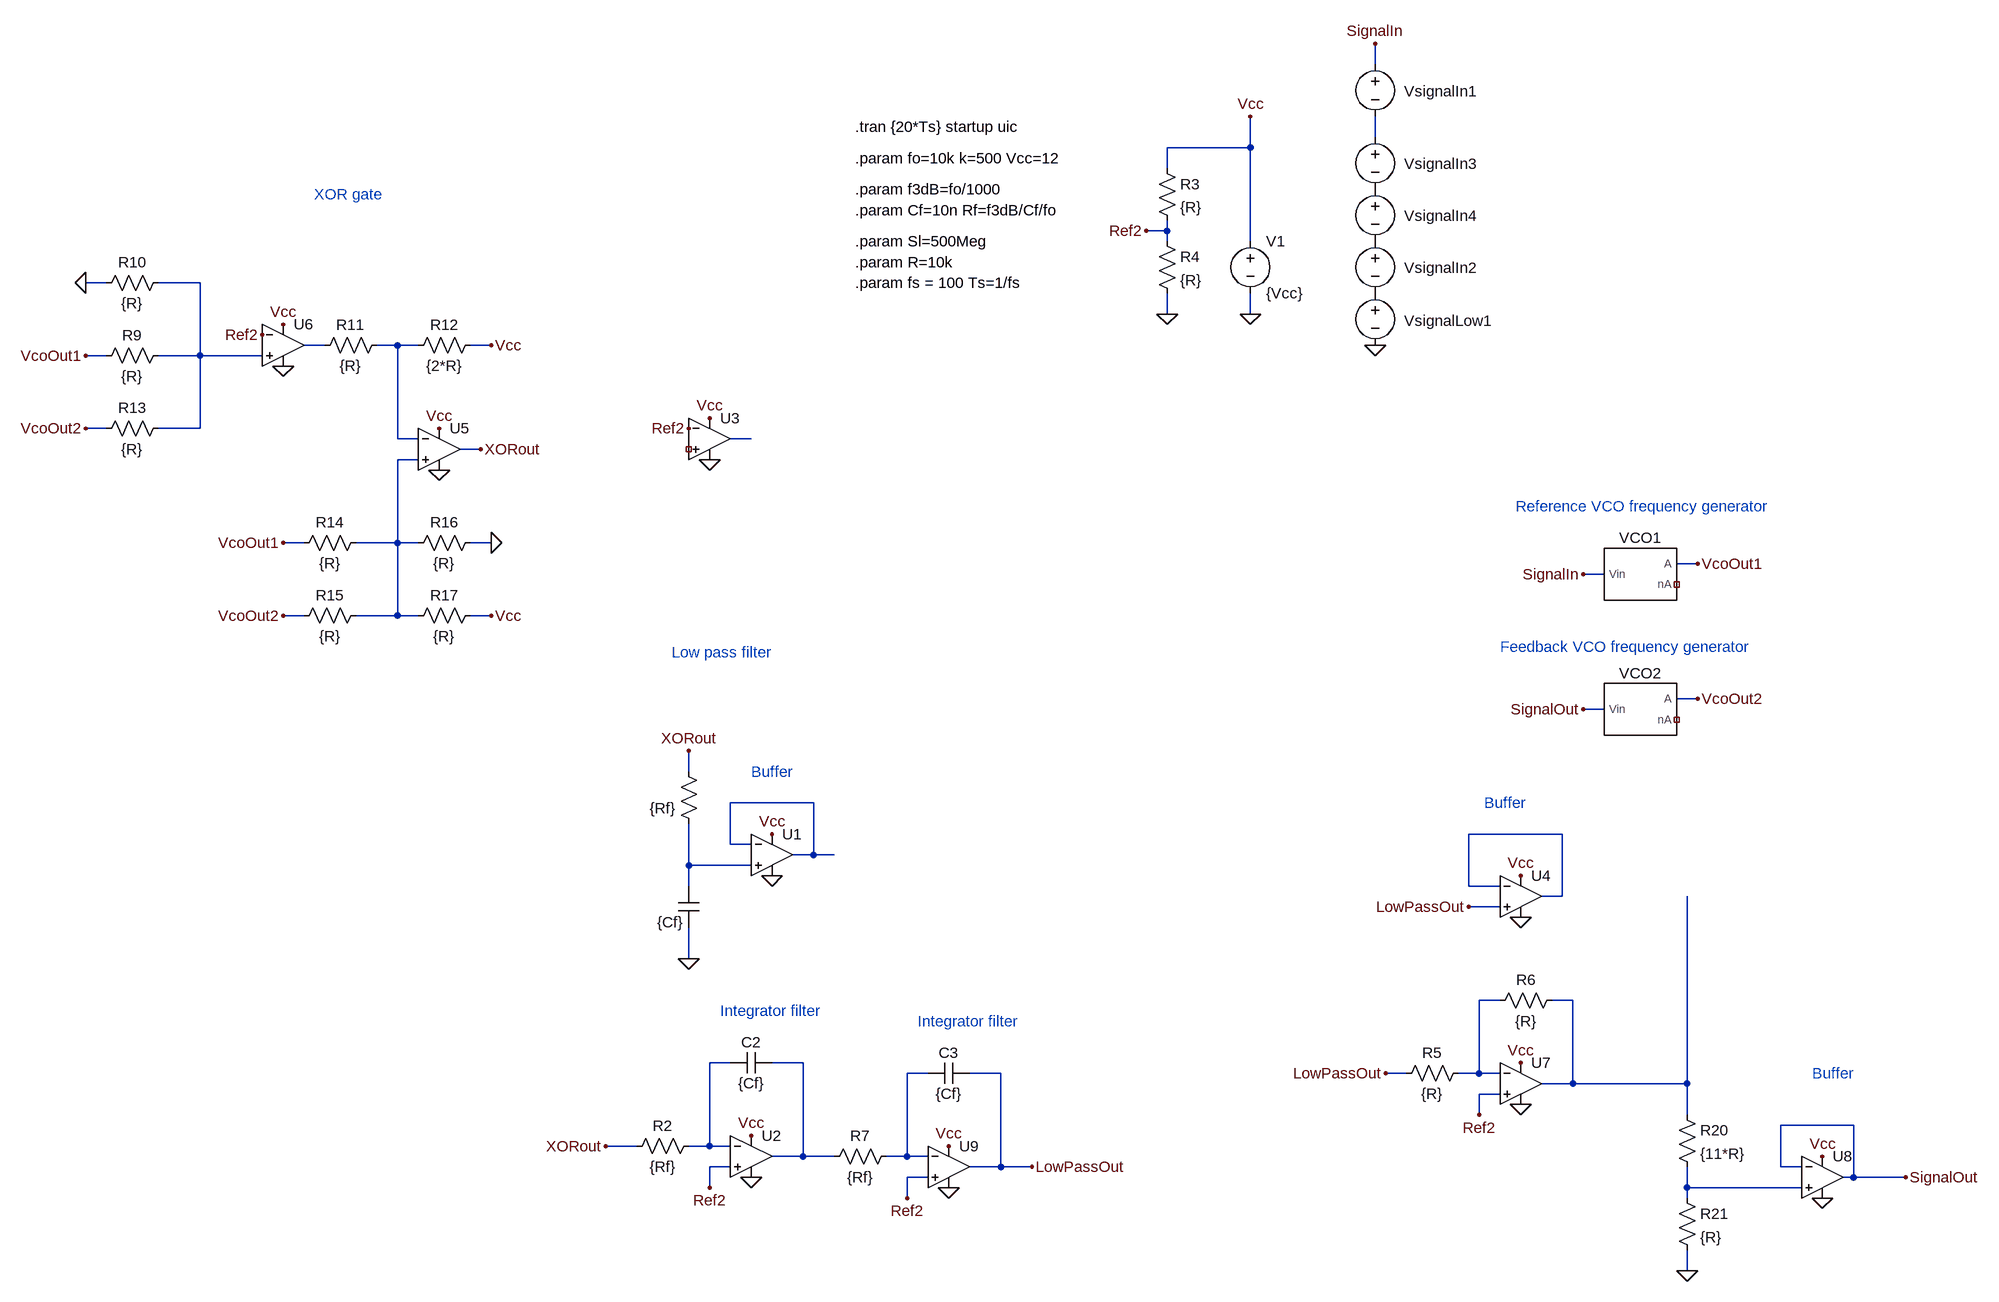
[diagram p0: schematic pll4.asc]
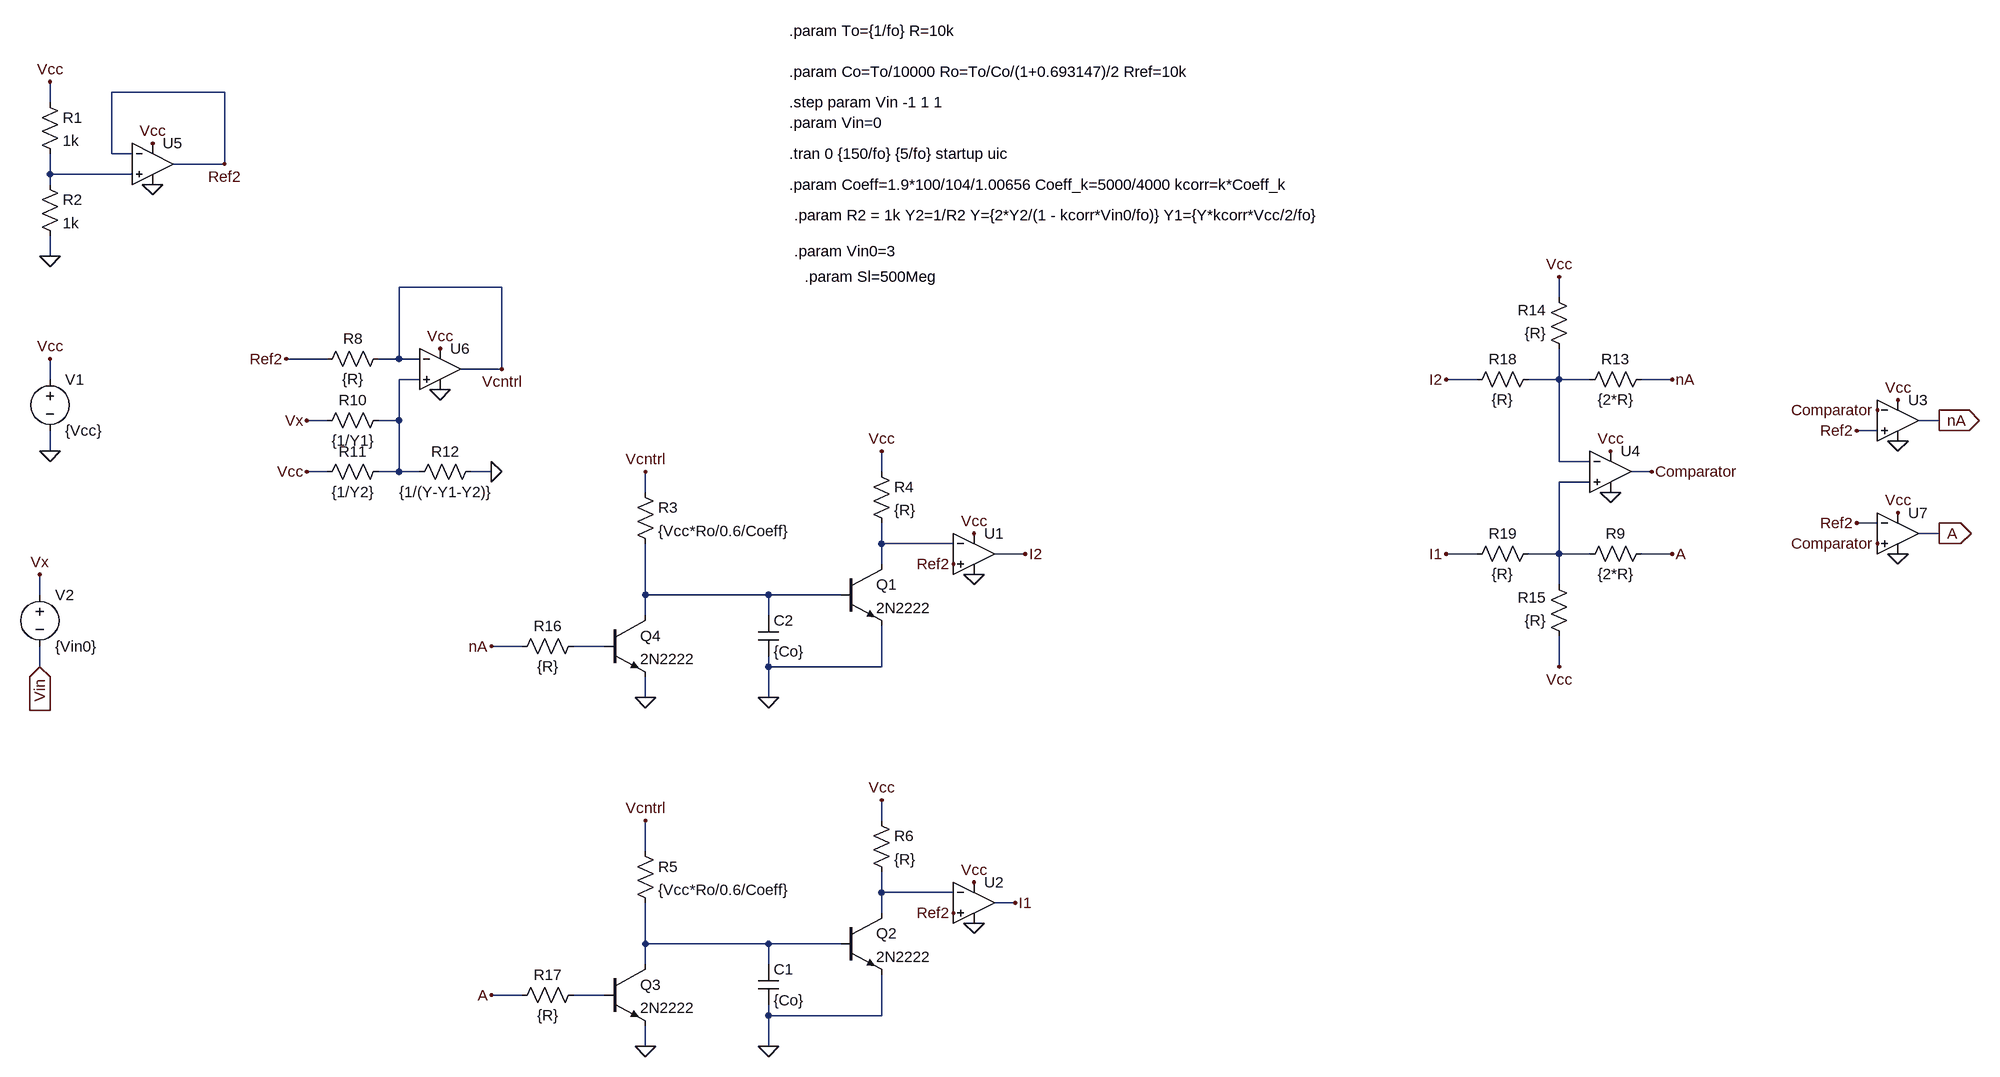
[diagram p1: sub-circuit vco_comp.asc]
pll4.asc, the LTspice schematic file:
Version 4
SHEET 1 3376 1836
WIRE 160 -240 160 -272
WIRE 160 -128 160 -160
WIRE -32 -112 -32 -160
WIRE -32 -112 -160 -112
WIRE -160 -80 -160 -112
WIRE -160 16 -160 0
WIRE -160 16 -192 16
WIRE -160 32 -160 16
WIRE -32 32 -32 -112
WIRE -1792 96 -1824 96
WIRE -1648 96 -1712 96
WIRE -160 144 -160 112
WIRE -32 144 -32 112
WIRE -1456 192 -1488 192
WIRE -1344 192 -1376 192
WIRE -1312 192 -1344 192
WIRE -1200 192 -1232 192
WIRE -1792 208 -1824 208
WIRE -1648 208 -1648 96
WIRE -1648 208 -1712 208
WIRE -1552 208 -1648 208
WIRE -1792 320 -1824 320
WIRE -1648 320 -1648 208
WIRE -1648 320 -1712 320
WIRE -1344 336 -1344 192
WIRE -1312 336 -1344 336
WIRE -800 336 -832 336
WIRE -1216 352 -1248 352
WIRE -1312 368 -1344 368
WIRE -1488 496 -1520 496
WIRE -1344 496 -1344 368
WIRE -1344 496 -1408 496
WIRE -1312 496 -1344 496
WIRE -1200 496 -1232 496
WIRE 656 528 624 528
WIRE 512 544 480 544
WIRE -1488 608 -1520 608
WIRE -1344 608 -1344 496
WIRE -1344 608 -1408 608
WIRE -1312 608 -1344 608
WIRE -1200 608 -1232 608
WIRE 656 736 624 736
WIRE 512 752 480 752
WIRE -896 848 -896 816
WIRE -704 896 -832 896
WIRE 448 944 304 944
WIRE -832 960 -832 896
WIRE -800 960 -832 960
WIRE -704 976 -704 896
WIRE -704 976 -736 976
WIRE -672 976 -704 976
WIRE -896 992 -896 928
WIRE -800 992 -896 992
WIRE -896 1024 -896 992
WIRE 304 1024 304 944
WIRE 352 1024 304 1024
WIRE 448 1040 448 944
WIRE 448 1040 416 1040
WIRE 352 1056 304 1056
WIRE -896 1136 -896 1088
WIRE 352 1200 320 1200
WIRE 464 1200 432 1200
WIRE -832 1296 -864 1296
WIRE -720 1296 -768 1296
WIRE -528 1312 -560 1312
WIRE -416 1312 -464 1312
WIRE 208 1312 176 1312
WIRE 320 1312 320 1200
WIRE 320 1312 288 1312
WIRE 352 1312 320 1312
WIRE 464 1328 464 1200
WIRE 464 1328 416 1328
WIRE 640 1328 640 1040
WIRE 640 1328 464 1328
WIRE 352 1344 320 1344
WIRE 320 1376 320 1344
WIRE 640 1376 640 1328
WIRE 896 1392 784 1392
WIRE -976 1424 -1024 1424
WIRE -864 1424 -864 1296
WIRE -864 1424 -896 1424
WIRE -832 1424 -864 1424
WIRE -720 1440 -720 1296
WIRE -720 1440 -768 1440
WIRE -672 1440 -720 1440
WIRE -560 1440 -560 1312
WIRE -560 1440 -592 1440
WIRE -528 1440 -560 1440
WIRE -832 1456 -864 1456
WIRE -416 1456 -416 1312
WIRE -416 1456 -464 1456
WIRE -368 1456 -416 1456
WIRE 784 1456 784 1392
WIRE 816 1456 784 1456
WIRE -528 1472 -560 1472
WIRE 896 1472 896 1392
WIRE 896 1472 880 1472
WIRE 976 1472 896 1472
WIRE -864 1488 -864 1456
WIRE 640 1488 640 1456
WIRE 816 1488 640 1488
WIRE -560 1504 -560 1472
WIRE 640 1504 640 1488
WIRE 640 1616 640 1584
FLAG -896 1136 0
FLAG -896 816 XORout
FLAG -768 944 Vcc
FLAG -768 1008 0
FLAG -1216 352 XORout
FLAG 160 192 0
FLAG 160 -272 SignalIn
FLAG 304 1056 LowPassOut
FLAG 976 1472 SignalOut
FLAG 384 1008 Vcc
FLAG 384 1072 0
FLAG 480 752 SignalOut
FLAG 480 544 SignalIn
FLAG 656 528 VcoOut1
FLAG 656 736 VcoOut2
FLAG -1520 224 0
FLAG -1280 384 0
FLAG -1280 320 Vcc
FLAG -1520 160 Vcc
FLAG -1552 176 Ref2
FLAG -1200 192 Vcc
FLAG -1824 208 VcoOut1
FLAG -1824 320 VcoOut2
FLAG -1824 96 0
FLAG -1520 496 VcoOut1
FLAG -1520 608 VcoOut2
FLAG -1200 496 0
FLAG -1200 608 Vcc
FLAG 848 1440 Vcc
FLAG 848 1504 0
FLAG 640 1616 0
FLAG -32 144 0
FLAG -32 -160 Vcc
FLAG -800 1408 Vcc
FLAG -800 1472 0
FLAG -368 1456 LowPassOut
FLAG -192 16 Ref2
FLAG -160 144 0
FLAG -896 320 Ref2
FLAG -864 368 0
FLAG -864 304 Vcc
FLAG -864 1488 Ref2
FLAG 320 1376 Ref2
FLAG 384 1360 0
FLAG 384 1296 Vcc
FLAG 176 1312 LowPassOut
FLAG -1024 1424 XORout
FLAG -496 1424 Vcc
FLAG -496 1488 0
FLAG -560 1504 Ref2
SYMBOL res -880 944 R180
WINDOW 0 36 76 Invisible 2
WINDOW 3 36 40 Left 2
SYMATTR InstName R1
SYMATTR Value {Rf}
SYMBOL cap -880 1088 R180
WINDOW 0 24 56 Invisible 2
WINDOW 3 24 8 Left 2
SYMATTR InstName C1
SYMATTR Value {Cf}
SYMBOL voltage 160 -256 M0
WINDOW 123 0 0 Left 0
WINDOW 39 0 0 Left 0
WINDOW 0 -157 57 Left 2
WINDOW 3 -78 108 Invisible 2
SYMATTR InstName VsignalIn1
SYMATTR Value PULSE(0 0.5 {2*Ts} 100u 100u {0.9*Ts} {2*Ts} 5)
SYMBOL voltage 160 16 M0
WINDOW 123 0 0 Left 0
WINDOW 39 0 0 Left 0
WINDOW 0 -157 57 Left 2
WINDOW 3 -78 108 Invisible 2
SYMATTR InstName VsignalIn2
SYMATTR Value PULSE(0 0.5 {17*Ts} 100u 100u {0.9*Ts} {1*Ts} 1)
SYMBOL voltage 160 96 M0
WINDOW 123 0 0 Left 0
WINDOW 39 0 0 Left 0
WINDOW 0 -181 58 Left 2
WINDOW 3 -78 108 Invisible 2
SYMATTR InstName VsignalLow1
SYMATTR Value 0.25V
SYMBOL voltage 160 -144 M0
WINDOW 123 0 0 Left 0
WINDOW 39 0 0 Left 0
WINDOW 0 -157 57 Left 2
WINDOW 3 -78 108 Invisible 2
SYMATTR InstName VsignalIn3
SYMATTR Value PULSE(0 0.5 {13*Ts} 100u 100u {0.9*Ts} {1*Ts} 1)
SYMBOL voltage 160 -64 M0
WINDOW 123 0 0 Left 0
WINDOW 39 0 0 Left 0
WINDOW 0 -157 57 Left 2
WINDOW 3 -78 108 Invisible 2
SYMATTR InstName VsignalIn4
SYMATTR Value PULSE(0 0.5 {14*Ts} 100u 100u {0.9*Ts} {2*Ts} 1)
SYMBOL VCO_comp 560 544 R0
SYMATTR InstName VCO1
SYMATTR SpiceLine fo={fo} k={k} Vcc={Vcc}
SYMBOL VCO_comp 560 752 R0
SYMATTR InstName VCO2
SYMATTR SpiceLine fo={fo} k={k} Vcc={Vcc}
SYMBOL OpAmps\\UniversalOpAmp2 -768 976 R0
SYMATTR InstName U1
SYMBOL OpAmps\\UniversalOpAmp2 384 1040 R0
SYMATTR InstName U4
SYMBOL OpAmps\\UniversalOpAmp2 -1280 352 R0
SYMATTR InstName U5
SYMATTR Value2 Avol=1Meg GBW=10Meg Slew={Sl}
SYMBOL OpAmps\\UniversalOpAmp2 -1520 192 R0
SYMATTR InstName U6
SYMATTR Value2 Avol=1Meg GBW=10Meg Slew={Sl}
SYMBOL res -1696 192 R90
WINDOW 0 0 56 VBottom 2
WINDOW 3 32 56 VTop 2
SYMATTR InstName R9
SYMATTR Value {R}
SYMBOL res -1696 80 R90
WINDOW 0 0 56 VBottom 2
WINDOW 3 32 56 VTop 2
SYMATTR InstName R10
SYMATTR Value {R}
SYMBOL res -1360 176 R90
WINDOW 0 0 56 VBottom 2
WINDOW 3 32 56 VTop 2
SYMATTR InstName R11
SYMATTR Value {R}
SYMBOL res -1216 176 R90
WINDOW 0 0 56 VBottom 2
WINDOW 3 32 56 VTop 2
SYMATTR InstName R12
SYMATTR Value {2*R}
SYMBOL res -1696 304 R90
WINDOW 0 0 56 VBottom 2
WINDOW 3 32 56 VTop 2
SYMATTR InstName R13
SYMATTR Value {R}
SYMBOL res -1392 480 R90
WINDOW 0 0 56 VBottom 2
WINDOW 3 32 56 VTop 2
SYMATTR InstName R14
SYMATTR Value {R}
SYMBOL res -1392 592 R90
WINDOW 0 0 56 VBottom 2
WINDOW 3 32 56 VTop 2
SYMATTR InstName R15
SYMATTR Value {R}
SYMBOL res -1216 480 R90
WINDOW 0 0 56 VBottom 2
WINDOW 3 32 56 VTop 2
SYMATTR InstName R16
SYMATTR Value {R}
SYMBOL res -1216 592 R90
WINDOW 0 0 56 VBottom 2
WINDOW 3 32 56 VTop 2
SYMATTR InstName R17
SYMATTR Value {R}
SYMBOL OpAmps\\UniversalOpAmp2 848 1472 R0
SYMATTR InstName U8
SYMBOL res 624 1360 R0
SYMATTR InstName R20
SYMATTR Value {11*R}
SYMBOL res 624 1488 R0
SYMATTR InstName R21
SYMATTR Value {R}
SYMBOL voltage -32 16 R0
SYMATTR InstName V1
SYMATTR Value {Vcc}
SYMBOL res -992 1440 R270
WINDOW 0 32 56 VTop 2
WINDOW 3 0 56 VBottom 2
SYMATTR InstName R2
SYMATTR Value {Rf}
SYMBOL cap -832 1312 R270
WINDOW 0 32 32 VTop 2
WINDOW 3 0 32 VBottom 2
SYMATTR InstName C2
SYMATTR Value {Cf}
SYMBOL OpAmps\\UniversalOpAmp2 -800 1440 R0
SYMATTR InstName U2
SYMBOL OpAmps\\UniversalOpAmp2 -864 336 R0
SYMATTR InstName U3
SYMATTR Value2 Avol=1Meg GBW=10Meg Slew={Sl}
SYMBOL res -176 -96 R0
SYMATTR InstName R3
SYMATTR Value {R}
SYMBOL res -176 16 R0
SYMATTR InstName R4
SYMATTR Value {R}
SYMBOL OpAmps\\UniversalOpAmp2 384 1328 R0
SYMATTR InstName U7
SYMATTR Value2 Avol=1Meg GBW=10Meg Slew={Sl}
SYMBOL res 304 1296 R90
WINDOW 0 0 56 VBottom 2
WINDOW 3 32 56 VTop 2
SYMATTR InstName R5
SYMATTR Value {R}
SYMBOL res 448 1184 R90
WINDOW 0 0 56 VBottom 2
WINDOW 3 32 56 VTop 2
SYMATTR InstName R6
SYMATTR Value {R}
SYMBOL res -688 1456 R270
WINDOW 0 32 56 VTop 2
WINDOW 3 0 56 VBottom 2
SYMATTR InstName R7
SYMATTR Value {Rf}
SYMBOL cap -528 1328 R270
WINDOW 0 32 32 VTop 2
WINDOW 3 0 32 VBottom 2
SYMATTR InstName C3
SYMATTR Value {Cf}
SYMBOL OpAmps\\UniversalOpAmp2 -496 1456 R0
SYMATTR InstName U9
TEXT -640 -144 Left 2 !.tran {20*Ts} startup uic
TEXT -768 664 Right 2 ;Low pass filter
TEXT 376 440 Left 2 ;Reference VCO frequency generator
TEXT 352 656 Left 2 ;Feedback VCO frequency generator
TEXT -800 848 Left 2 ;Buffer
TEXT 328 896 Left 2 ;Buffer
TEXT -640 -96 Left 2 !.param fo=10k k=500 Vcc=12
TEXT -1472 -40 Left 2 ;XOR gate
TEXT -640 64 Left 2 !.param R=10k
TEXT -640 -16 Left 2 !.param Cf=10n Rf=f3dB/Cf/fo
TEXT 832 1312 Left 2 ;Buffer
TEXT -640 32 Left 2 !.param Sl=500Meg
TEXT -640 96 Left 2 !.param fs = 100 Ts=1/fs
TEXT -640 -48 Left 2 !.param f3dB=fo/1000
TEXT -848 1216 Left 2 ;Integrator filter
TEXT -544 1232 Left 2 ;Integrator filter

vco_comp.asc, the sub-circuit schematic file:
Version 4
SHEET 1 2680 1780
WIRE -80 -96 -256 -96
WIRE -352 -80 -352 -112
WIRE -256 0 -256 -96
WIRE -224 0 -256 0
WIRE -80 16 -80 -96
WIRE -80 16 -160 16
WIRE -352 32 -352 0
WIRE -224 32 -352 32
WIRE -352 48 -352 32
WIRE -352 160 -352 128
WIRE 352 208 192 208
WIRE 2000 224 2000 192
WIRE 80 320 16 320
WIRE 192 320 192 208
WIRE 192 320 160 320
WIRE 224 320 192 320
WIRE 352 336 352 208
WIRE 352 336 288 336
WIRE -352 352 -352 320
WIRE 224 352 192 352
WIRE 1872 352 1824 352
WIRE 2000 352 2000 304
WIRE 2000 352 1952 352
WIRE 2048 352 2000 352
WIRE 2176 352 2128 352
WIRE 80 416 48 416
WIRE 192 416 192 352
WIRE 192 416 160 416
WIRE 2592 416 2560 416
WIRE 2496 432 2464 432
WIRE -352 464 -352 432
WIRE 2000 480 2000 352
WIRE 2048 480 2000 480
WIRE 80 496 48 496
WIRE 192 496 192 416
WIRE 192 496 160 496
WIRE 224 496 192 496
WIRE 336 496 304 496
WIRE 944 496 944 464
WIRE 2144 496 2112 496
WIRE 2048 512 2000 512
WIRE 576 528 576 496
WIRE 2496 576 2464 576
WIRE 2592 592 2560 592
WIRE 944 608 944 576
WIRE 1056 608 944 608
WIRE 1168 624 1120 624
WIRE 1872 624 1824 624
WIRE 2000 624 2000 512
WIRE 2000 624 1952 624
WIRE 2048 624 2000 624
WIRE 2176 624 2128 624
WIRE 944 640 944 608
WIRE 2000 672 2000 624
WIRE -368 688 -368 656
WIRE 576 688 576 608
WIRE 768 688 576 688
WIRE 880 688 768 688
WIRE 576 720 576 688
WIRE 768 720 768 688
WIRE 384 768 336 768
WIRE 512 768 464 768
WIRE -368 800 -368 768
WIRE 768 800 768 784
WIRE 944 800 944 736
WIRE 944 800 768 800
WIRE 2000 800 2000 752
WIRE 576 848 576 816
WIRE 768 848 768 800
WIRE 944 1040 944 1008
WIRE 576 1088 576 1040
WIRE 944 1152 944 1120
WIRE 1056 1152 944 1152
WIRE 1152 1168 1120 1168
WIRE 944 1184 944 1152
WIRE 576 1232 576 1168
WIRE 768 1232 576 1232
WIRE 880 1232 768 1232
WIRE 576 1264 576 1232
WIRE 768 1264 768 1232
WIRE 384 1312 336 1312
WIRE 512 1312 464 1312
WIRE 768 1344 768 1328
WIRE 944 1344 944 1280
WIRE 944 1344 768 1344
WIRE 576 1392 576 1360
WIRE 768 1392 768 1344
FLAG -352 464 0
FLAG -352 320 Vcc
FLAG -352 160 0
FLAG -352 -112 Vcc
FLAG -80 16 Ref2
FLAG 2464 432 Ref2
FLAG 2080 464 Vcc
FLAG 2528 384 Vcc
FLAG 2080 528 0
FLAG 2528 448 0
FLAG 2592 592 A
IOPIN 2592 592 Out
FLAG 2592 416 nA
IOPIN 2592 416 Out
FLAG 2000 192 Vcc
FLAG 2000 800 Vcc
FLAG 1824 624 I1
FLAG 1824 352 I2
FLAG -368 656 Vx
FLAG -192 48 0
FLAG -192 -16 Vcc
FLAG 576 848 0
FLAG 768 848 0
FLAG 944 464 Vcc
FLAG 576 1392 0
FLAG 768 1392 0
FLAG 944 1008 Vcc
FLAG 1168 624 I2
FLAG 1152 1168 I1
FLAG 336 1312 A
FLAG 336 768 nA
FLAG 1088 656 0
FLAG 1088 592 Vcc
FLAG 1056 640 Ref2
FLAG 1088 1200 0
FLAG 1088 1136 Vcc
FLAG 1056 1184 Ref2
FLAG 16 320 Ref2
FLAG 256 304 Vcc
FLAG 256 368 0
FLAG 48 496 Vcc
FLAG 336 496 0
FLAG 48 416 Vx
FLAG 352 336 Vcntrl
FLAG 576 496 Vcntrl
FLAG 576 1040 Vcntrl
FLAG 2464 576 Ref2
FLAG 2528 560 Vcc
FLAG 2528 624 0
FLAG 2176 624 A
FLAG 2176 352 nA
FLAG 2144 496 Comparator
FLAG 2496 400 Comparator
FLAG 2496 608 Comparator
FLAG -368 800 Vin
IOPIN -368 800 In
SYMBOL voltage -352 336 R0
WINDOW 123 0 0 Left 0
WINDOW 39 0 0 Left 0
SYMATTR InstName V1
SYMATTR Value {Vcc}
SYMBOL res -368 -96 R0
SYMATTR InstName R1
SYMATTR Value 1k
SYMBOL res -368 32 R0
SYMATTR InstName R2
SYMATTR Value 1k
SYMBOL OpAmps\\UniversalOpAmp2 2528 416 R0
SYMATTR InstName U3
SYMATTR Value2 Avol=1Meg GBW=10Meg Slew={Sl}
SYMBOL OpAmps\\UniversalOpAmp2 2080 496 R0
SYMATTR InstName U4
SYMATTR Value2 Avol=1Meg GBW=10Meg Slew={Sl}
SYMBOL res 2144 608 R90
WINDOW 0 0 56 VBottom 2
WINDOW 3 32 56 VTop 2
SYMATTR InstName R9
SYMATTR Value {2*R}
SYMBOL res 2144 336 R90
WINDOW 0 0 56 VBottom 2
WINDOW 3 32 56 VTop 2
SYMATTR InstName R13
SYMATTR Value {2*R}
SYMBOL res 2016 320 R180
WINDOW 0 36 76 Left 2
WINDOW 3 36 40 Left 2
SYMATTR InstName R14
SYMATTR Value {R}
SYMBOL res 2016 768 R180
WINDOW 0 36 76 Left 2
WINDOW 3 36 40 Left 2
SYMATTR InstName R15
SYMATTR Value {R}
SYMBOL voltage -368 672 R0
WINDOW 123 0 0 Left 0
WINDOW 39 0 0 Left 0
SYMATTR InstName V2
SYMATTR Value {Vin0}
SYMBOL OpAmps\\UniversalOpAmp2 -192 16 R0
SYMATTR InstName U5
SYMBOL npn 880 640 R0
SYMATTR InstName Q1
SYMATTR Value 2N2222
SYMBOL res 560 512 R0
SYMATTR InstName R3
SYMATTR Value {Vcc*Ro/0.6/Coeff}
SYMBOL cap 752 720 R0
SYMATTR InstName C2
SYMATTR Value {Co}
SYMBOL res 928 480 R0
SYMATTR InstName R4
SYMATTR Value {R}
SYMBOL npn 880 1184 R0
SYMATTR InstName Q2
SYMATTR Value 2N2222
SYMBOL res 560 1072 R0
SYMATTR InstName R5
SYMATTR Value {Vcc*Ro/0.6/Coeff}
SYMBOL cap 752 1264 R0
SYMATTR InstName C1
SYMATTR Value {Co}
SYMBOL res 928 1024 R0
SYMATTR InstName R6
SYMATTR Value {R}
SYMBOL OpAmps\\UniversalOpAmp2 1088 624 R0
SYMATTR InstName U1
SYMATTR Value2 Avol=1Meg GBW=10Meg Slew={Sl}
SYMBOL OpAmps\\UniversalOpAmp2 1088 1168 R0
SYMATTR InstName U2
SYMATTR Value2 Avol=1Meg GBW=10Meg Slew={Sl}
SYMBOL OpAmps\\UniversalOpAmp2 256 336 R0
SYMATTR InstName U6
SYMBOL res 176 304 R90
WINDOW 0 0 56 VBottom 2
WINDOW 3 32 56 VTop 2
SYMATTR InstName R8
SYMATTR Value {R}
SYMBOL res 176 400 R90
WINDOW 0 0 56 VBottom 2
WINDOW 3 32 56 VTop 2
SYMATTR InstName R10
SYMATTR Value {1/Y1}
SYMBOL res 176 480 R90
WINDOW 0 0 56 VBottom 2
WINDOW 3 32 56 VTop 2
SYMATTR InstName R11
SYMATTR Value {1/Y2}
SYMBOL res 320 480 R90
WINDOW 0 0 56 VBottom 2
WINDOW 3 32 56 VTop 2
SYMATTR InstName R12
SYMATTR Value {1/(Y-Y1-Y2)}
SYMBOL npn 512 1264 R0
SYMATTR InstName Q3
SYMATTR Value 2N2222
SYMBOL npn 512 720 R0
SYMATTR InstName Q4
SYMATTR Value 2N2222
SYMBOL res 480 752 R90
WINDOW 0 0 56 VBottom 2
WINDOW 3 32 56 VTop 2
SYMATTR InstName R16
SYMATTR Value {R}
SYMBOL res 480 1296 R90
WINDOW 0 0 56 VBottom 2
WINDOW 3 32 56 VTop 2
SYMATTR InstName R17
SYMATTR Value {R}
SYMBOL res 1856 368 R270
WINDOW 0 32 56 VTop 2
WINDOW 3 0 56 VBottom 2
SYMATTR InstName R18
SYMATTR Value {R}
SYMBOL res 1856 640 R270
WINDOW 0 32 56 VTop 2
WINDOW 3 0 56 VBottom 2
SYMATTR InstName R19
SYMATTR Value {R}
SYMBOL OpAmps\\UniversalOpAmp2 2528 592 R0
SYMATTR InstName U7
SYMATTR Value2 Avol=1Meg GBW=10Meg Slew={Sl}
TEXT 800 0 Left 2 !.tran 0 {150/fo} {5/fo} startup uic
TEXT 800 -128 Left 2 !.param Co=To/10000 Ro=To/Co/(1+0.693147)/2 Rref=10k
TEXT 800 -80 Left 2 !.step param Vin -1 1 1
TEXT 800 -48 Left 2 !.param Vin=0
TEXT 800 -192 Left 2 !.param To={1/fo} R=10k
TEXT 800 48 Left 2 !.param Coeff=1.9*100/104/1.00656 Coeff_k=5000/4000 kcorr=k*Coeff_k
TEXT 808 96 Left 2 !.param R2 = 1k Y2=1/R2 Y={2*Y2/(1 - kcorr*Vin0/fo)} Y1={Y*kcorr*Vcc/2/fo}
TEXT 808 152 Left 2 !.param Vin0=3
TEXT 824 192 Left 2 !.param Sl=500Meg

The netlist it stands for:
* pll4.asc
R1 N009 XORout {Rf}
C1 0 N009 {Cf}
VsignalIn1 SignalIn N001 PULSE(0 0.5 {2*Ts} 100u 100u {0.9*Ts} {2*Ts} 5)
VsignalIn2 P001 P002 PULSE(0 0.5 {17*Ts} 100u 100u {0.9*Ts} {1*Ts} 1)
VsignalLow1 P002 0 0.25V
VsignalIn3 N001 P003 PULSE(0 0.5 {13*Ts} 100u 100u {0.9*Ts} {1*Ts} 1)
VsignalIn4 P003 P001 PULSE(0 0.5 {14*Ts} 100u 100u {0.9*Ts} {2*Ts} 1)
XVCO1 SignalIn VcoOut1 NC_01 vco_comp params: fo={fo} k={k} Vcc={Vcc}
XVCO2 SignalOut VcoOut2 NC_02 vco_comp params: fo={fo} k={k} Vcc={Vcc}
XU1 N009 N007 Vcc 0 N007 level2 Avol=1Meg GBW=10Meg Slew=10Meg Ilimit=25m Rail=0 Vos=0 En=0 Enk=0 In=0 Ink=0 Rin=500Meg  ; pins In+ In- V+ V- OUT
XU4 LowPassOut N008 Vcc 0 N008 level2 Avol=1Meg GBW=10Meg Slew=10Meg Ilimit=25m Rail=0 Vos=0 En=0 Enk=0 In=0 Ink=0 Rin=500Meg  ; pins In+ In- V+ V- OUT
XU5 N006 N004 Vcc 0 XORout level2 Avol=1Meg GBW=10Meg Slew={Sl} Ilimit=25m Rail=0 Vos=0 En=0 Enk=0 In=0 Ink=0 Rin=500Meg  ; pins In+ In- V+ V- OUT
XU6 N002 Ref2 Vcc 0 N003 level2 Avol=1Meg GBW=10Meg Slew={Sl} Ilimit=25m Rail=0 Vos=0 En=0 Enk=0 In=0 Ink=0 Rin=500Meg  ; pins In+ In- V+ V- OUT
R9 N002 VcoOut1 {R}
R10 N002 0 {R}
R11 N004 N003 {R}
R12 Vcc N004 {2*R}
R13 N002 VcoOut2 {R}
R14 N006 VcoOut1 {R}
R15 N006 VcoOut2 {R}
R16 0 N006 {R}
R17 Vcc N006 {R}
XU8 N015 SignalOut Vcc 0 SignalOut level2 Avol=1Meg GBW=10Meg Slew=10Meg Ilimit=25m Rail=0 Vos=0 En=0 Enk=0 In=0 Ink=0 Rin=500Meg  ; pins In+ In- V+ V- OUT
R20 N011 N015 {11*R}
R21 N015 0 {R}
V1 Vcc 0 {Vcc}
R2 XORout N012 {Rf}
C2 N012 N013 {Cf}
XU2 Ref2 N012 Vcc 0 N013 level2 Avol=1Meg GBW=10Meg Slew=10Meg Ilimit=25m Rail=0 Vos=0 En=0 Enk=0 In=0 Ink=0 Rin=500Meg  ; pins In+ In- V+ V- OUT
XU3 NC_03 Ref2 Vcc 0 N005 level2 Avol=1Meg GBW=10Meg Slew={Sl} Ilimit=25m Rail=0 Vos=0 En=0 Enk=0 In=0 Ink=0 Rin=500Meg  ; pins In+ In- V+ V- OUT
R3 Vcc Ref2 {R}
R4 Ref2 0 {R}
XU7 Ref2 N010 Vcc 0 N011 level2 Avol=1Meg GBW=10Meg Slew={Sl} Ilimit=25m Rail=0 Vos=0 En=0 Enk=0 In=0 Ink=0 Rin=500Meg  ; pins In+ In- V+ V- OUT
R5 N010 LowPassOut {R}
R6 N011 N010 {R}
R7 N013 N014 {Rf}
C3 N014 LowPassOut {Cf}
XU9 Ref2 N014 Vcc 0 LowPassOut level2 Avol=1Meg GBW=10Meg Slew=10Meg Ilimit=25m Rail=0 Vos=0 En=0 Enk=0 In=0 Ink=0 Rin=500Meg  ; pins In+ In- V+ V- OUT

* block symbol definitions
.subckt vco_comp Vin A nA
V1 Vcc 0 {Vcc}
R1 Vcc N001 1k
R2 N001 0 1k
XU3 Ref2 Comparator Vcc 0 nA level2 Avol=1Meg GBW=10Meg Slew={Sl} Ilimit=25m Rail=0 Vos=0 En=0 Enk=0 In=0 Ink=0 Rin=500Meg  ; pins In+ In- V+ V- OUT
XU4 N004 N003 Vcc 0 Comparator level2 Avol=1Meg GBW=10Meg Slew={Sl} Ilimit=25m Rail=0 Vos=0 En=0 Enk=0 In=0 Ink=0 Rin=500Meg  ; pins In+ In- V+ V- OUT
R9 A N004 {2*R}
R13 nA N003 {2*R}
R14 N003 Vcc {R}
R15 Vcc N004 {R}
V2 Vx Vin {Vin0}
XU5 N001 Ref2 Vcc 0 Ref2 level2 Avol=1Meg GBW=10Meg Slew=10Meg Ilimit=25m Rail=0 Vos=0 En=0 Enk=0 In=0 Ink=0 Rin=500Meg  ; pins In+ In- V+ V- OUT
Q1 N005 N006 0 0 2N2222
R3 Vcntrl N006 {Vcc*Ro/0.6/Coeff}
C2 N006 0 {Co}
R4 Vcc N005 {R}
Q2 N008 N009 0 0 2N2222
R5 Vcntrl N009 {Vcc*Ro/0.6/Coeff}
C1 N009 0 {Co}
R6 Vcc N008 {R}
XU1 Ref2 N005 Vcc 0 I2 level2 Avol=1Meg GBW=10Meg Slew={Sl} Ilimit=25m Rail=0 Vos=0 En=0 Enk=0 In=0 Ink=0 Rin=500Meg  ; pins In+ In- V+ V- OUT
XU2 Ref2 N008 Vcc 0 I1 level2 Avol=1Meg GBW=10Meg Slew={Sl} Ilimit=25m Rail=0 Vos=0 En=0 Enk=0 In=0 Ink=0 Rin=500Meg  ; pins In+ In- V+ V- OUT
XU6 N002 Vcntrl Vcc 0 Vcntrl level2 Avol=1Meg GBW=10Meg Slew=10Meg Ilimit=25m Rail=0 Vos=0 En=0 Enk=0 In=0 Ink=0 Rin=500Meg  ; pins In+ In- V+ V- OUT
R8 Vcntrl Ref2 {R}
R10 N002 Vx {1/Y1}
R11 N002 Vcc {1/Y2}
R12 0 N002 {1/(Y-Y1-Y2)}
Q3 N009 N010 0 0 2N2222
Q4 N006 N007 0 0 2N2222
R16 N007 nA {R}
R17 N010 A {R}
R18 I2 N003 {R}
R19 I1 N004 {R}
XU7 Comparator Ref2 Vcc 0 A level2 Avol=1Meg GBW=10Meg Slew={Sl} Ilimit=25m Rail=0 Vos=0 En=0 Enk=0 In=0 Ink=0 Rin=500Meg  ; pins In+ In- V+ V- OUT
.tran 0 {150/fo} {5/fo} startup uic
.param Co=To/10000 Ro=To/Co/(1+0.693147)/2 Rref=10k
.step param Vin -1 1 1
.param Vin=0
.param To={1/fo} R=10k
.param Coeff=1.9*100/104/1.00656 Coeff_k=5000/4000 kcorr=k*Coeff_k
.param R2 = 1k Y2=1/R2 Y={2*Y2/(1 - kcorr*Vin0/fo)} Y1={Y*kcorr*Vcc/2/fo}
.param Vin0=3
.param Sl=500Meg
.ends vco_comp

.model NPN NPN
.model PNP PNP
.lib standard.bjt
.tran {20*Ts} startup uic
* Low pass filter
* Reference VCO frequency generator
* Feedback VCO frequency generator
* Buffer
* Buffer
.param fo=10k k=500 Vcc=12
* XOR gate
.param R=10k
.param Cf=10n Rf=f3dB/Cf/fo
* Buffer
.param Sl=500Meg
.param fs = 100 Ts=1/fs
.param f3dB=fo/1000
* Integrator filter
* Integrator filter
.lib UniversalOpAmp2.lib
.backanno
.end